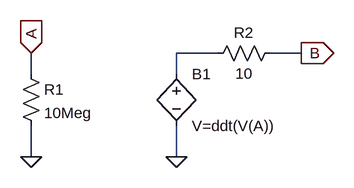
[diagram p0: schematic Differentiator5.asc]
Differentiator5.asc, the LTspice schematic file:
Version 4
SHEET 1 880 680
WIRE 0 80 -64 80
WIRE 128 80 80 80
WIRE -288 112 -288 80
WIRE -64 112 -64 80
WIRE -288 240 -288 192
WIRE -64 240 -64 192
FLAG -64 240 0
FLAG 128 80 B
IOPIN 128 80 Out
FLAG -288 80 A
IOPIN -288 80 In
FLAG -288 240 0
SYMBOL bv -64 96 R0
SYMATTR InstName B1
SYMATTR Value V=ddt(V(A))
SYMBOL res -304 96 R0
SYMATTR InstName R1
SYMATTR Value 10Meg
SYMBOL res 96 64 R90
WINDOW 0 0 56 VBottom 2
WINDOW 3 32 56 VTop 2
SYMATTR InstName R2
SYMATTR Value 10

The netlist it stands for:
* Differentiator5.asc
B1 N001 0 V=ddt(V(A))
R1 A 0 10Meg
R2 B N001 10
.backanno
.end